# Altium project iiot.PrjPcb
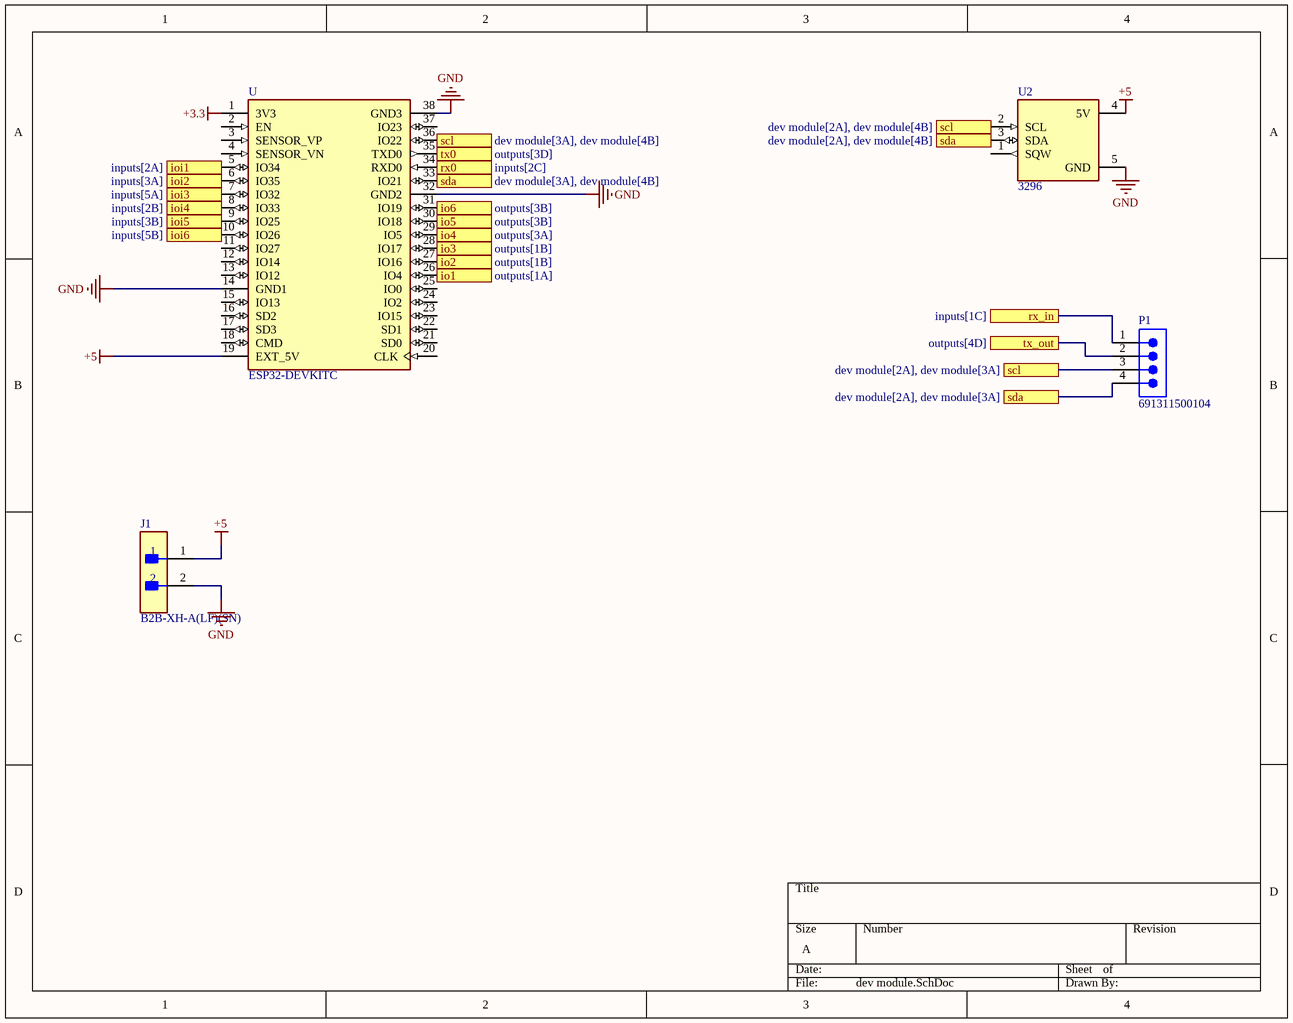
[diagram p0: dev module.SchDoc]
3 sheets, 87 parts. Net scope: flat (ports and power ports of the same name join across sheets).
Board file: with dev module.PcbDoc
Sheets:
  dev module.SchDoc
  outputs.SchDoc
  inputs.SchDoc

## Sheet dev module.SchDoc
size A; SheetNumber: 1; SheetTotal: 3

### Parts
J1  B2B-XH-A(LF)(SN)  [FP-B2B-XH-A_LF_SN-MFG]
P1  691311500104  [691311500104]
U  ESP32-DEVKITC  [MODULE_ESP32-DEVKITC]
U2  3296  [MODULE_3296]

### Ports
io1 (see outputs[1A]), io2 (see outputs[1B]), io3 (see outputs[1B]), io4 (see outputs[3A]), io5 (see outputs[3B]), io6 (see outputs[3B]), ioi1 (see inputs[2A]), ioi2 (see inputs[3A]), ioi3 (see inputs[5A]), ioi4 (see inputs[2B]), ioi5 (see inputs[3B]), ioi6 (see inputs[5B]), rx0 (see inputs[2C]), rx_in (see inputs[1C]), scl (see dev module[2A], dev module[3A]), scl (see dev module[2A], dev module[4B]), scl (see dev module[3A], dev module[4B]), sda (see dev module[2A], dev module[3A]), sda (see dev module[2A], dev module[4B]), sda (see dev module[3A], dev module[4B]), tx0 (see outputs[3D]), tx_out (see outputs[4D])

### Nets
+3.3: U.1(3V3)
+5: J1.1 U.19(EXT_5V) U2.4(5V)
GND: J1.2 U.14(GND1) U.32(GND2) U.38(GND3) U2.5(GND)
NetP1_1: P1.1 ; port rx_in
NetP1_2: P1.2 ; port tx_out
NetP1_3: P1.3 U.36(IO22) U2.2(SCL) ; port scl
NetP1_4: P1.4 U.33(IO21) U2.3(SDA) ; port sda
NetQ14_4: U.5(IO34) ; port ioi1
NetQ15_4: U.6(IO35) ; port ioi2
NetQ16_4: U.7(IO32) ; port ioi3
NetQ17_4: U.8(IO33) ; port ioi4
NetQ18_4: U.9(IO25) ; port ioi5
NetQ19_4: U.10(IO26) ; port ioi6
NetR1_2: U.26(IO4) ; port io1
NetR2_2: U.29(IO5) ; port io4
NetR19_2: U.27(IO16) ; port io2
NetR20_2: U.30(IO18) ; port io5
NetR23_2: U.28(IO17) ; port io3
NetR24_2: U.31(IO19) ; port io6
NetR28_2: U.35(TXD0) ; port tx0
NetU_34: U.34(RXD0) ; port rx0

Not connected (* = marked no-connect by the designer): U 2(EN) 3(SENSOR_VP) 4(SENSOR_VN) 11(IO27) 12(IO14) 13(IO12) 15(IO13) 16(SD2) 17(SD3) 18(CMD) 20(CLK) 21(SD0) 22(SD1) 23(IO15) 24(IO2) 25(IO0) 37(IO23); U2 1(SQW)

### Library data of the parts
J1 = CMP-2000-05888-3: CONN HEADER VERT 2POS 2.5MM; Current Rating: 3A; Voltage Rating: 250V; Number of Contacts: 2; Contact Resistance: 20mR; Wire/Cable Gauge: 22AWG; Insulation Resistance: 1GR; Connector Type: Male Pin; Packaging: Bulk; Contact Material: Brass; Lead Free: Lead Free; Orientation: Straight; Contact Plating: Tin; Max Current Rating: 3A; Termination: Solder; Fastening Type: Detent; Depth: 5.75mm; Housing Material: Polyamide; REACH SVHC: No SVHC; Series: XH; Voltage Rating (AC): 250V; Number of Positions: 2; Color: Natural; Contact Type: Male Pin; Max Voltage Rating (DC): 250V; Pitch: 2.5mm; Lead Pitch: 2.5mm; Mount: Through Hole; Max Operating Temperature: 85°C; Length: 7.4mm; Max Voltage Rating (AC): 250V; Min Operating Temperature: -25°C; Number of Rows: 1; Housing Color: White
P1 = CMP-1502-02148-2: NexarPartId: 8917749; Pitch: 5.08mm; Number of Positions Per Level: 4; Gender: Male; Voltage: 300V; Current: 20A; Number of Levels: 1; Orientation: Vertical; Number of Pins: 4; Mount: Through Hole; Number of Contacts: 4; Length: 8.5mm; Number of Rows: 1; Contact Plating: Tin; Color: Green; Termination: Solder; Contact Material: Brass; REACH SVHC: Unknown; RoHS: Compliant; Lead Pitch: 5.08mm; Width: 22.32mm; Height: 12mm; Packaging: Box
U = ESP32-DEVKITC: - Transceiver; 802.11 b/g/n _Wi-Fi, WiFi, WLAN_, BluetoothÂ® Smart Ready 4.x Dual Mode For Use With ESP-WROOM-32; MP: ESP32-DEVKITC-32D-F; MF: Espressif Systems; Price: None; SnapEDA_Link: https://www.snapeda.com/parts/ESP32-DEVKITC-32D-F/Espressif%20Systems/view-part/4220172/?ref=snap; Availability: Unavailable; Value: *; Package: None
U2 = 3296: DS1307 Real Time Clock (RTC) Timing Evaluation Board; MF: Adafruit; Package: None; Price: None; Check_prices: https://www.snapeda.com/parts/3296/Adafruit+Industries/view-part/?ref=eda; Value: *; SnapEDA_Link: https://www.snapeda.com/parts/3296/Adafruit+Industries/view-part/?ref=snap; MP: 3296; Availability: In Stock; Purchase-URL: https://pricing.snapeda.com/search/part/3296/?ref=eda

## Sheet outputs.SchDoc
size B; SheetNumber: 2; SheetTotal: 3
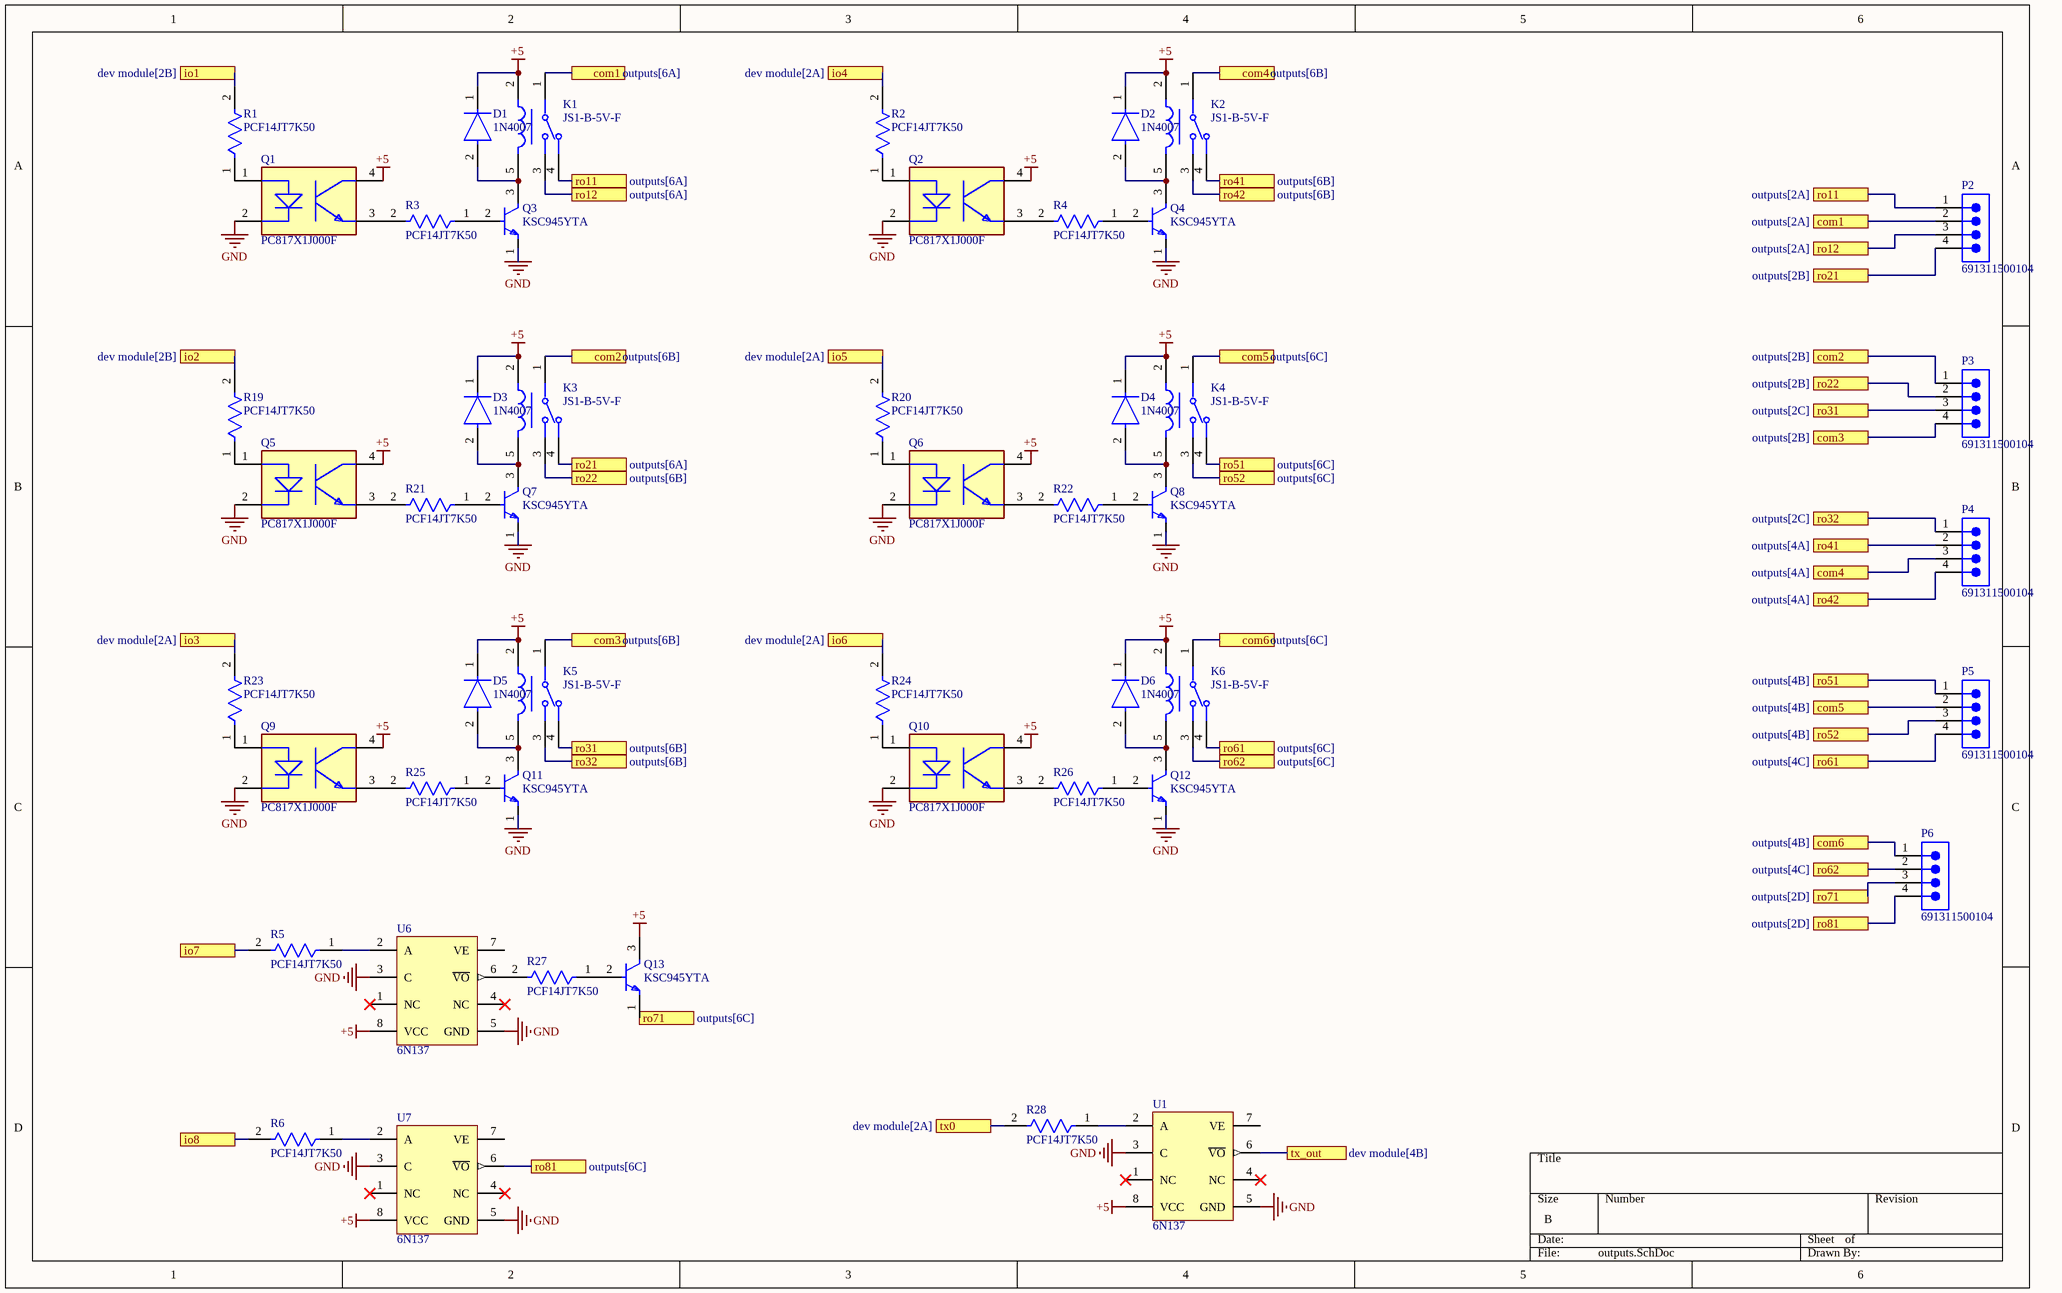
[diagram p1: outputs.SchDoc]

### Parts
D1  1N4007  [FP-1N4007-MFG]
D2  1N4007  [FP-1N4007-MFG]
D3  1N4007  [FP-1N4007-MFG]
D4  1N4007  [FP-1N4007-MFG]
D5  1N4007  [FP-1N4007-MFG]
D6  1N4007  [FP-1N4007-MFG]
K1  JS1-B-5V-F  [FP-JS1-B-5V-F-MFG]
K2  JS1-B-5V-F  [FP-JS1-B-5V-F-MFG]
K3  JS1-B-5V-F  [FP-JS1-B-5V-F-MFG]
K4  JS1-B-5V-F  [FP-JS1-B-5V-F-MFG]
K5  JS1-B-5V-F  [FP-JS1-B-5V-F-MFG]
K6  JS1-B-5V-F  [FP-JS1-B-5V-F-MFG]
P2  691311500104  [691311500104]
P3  691311500104  [691311500104]
P4  691311500104  [691311500104]
P5  691311500104  [691311500104]
P6  691311500104  [691311500104]
Q1  PC817X1J000F  [FP-PC817X1J000F-MFG]
Q2  PC817X1J000F  [FP-PC817X1J000F-MFG]
Q3  KSC945YTA  [FP-135AR-MFG]
Q4  KSC945YTA  [FP-135AR-MFG]
Q5  PC817X1J000F  [FP-PC817X1J000F-MFG]
Q6  PC817X1J000F  [FP-PC817X1J000F-MFG]
Q7  KSC945YTA  [FP-135AR-MFG]
Q8  KSC945YTA  [FP-135AR-MFG]
Q9  PC817X1J000F  [FP-PC817X1J000F-MFG]
Q10  PC817X1J000F  [FP-PC817X1J000F-MFG]
Q11  KSC945YTA  [FP-135AR-MFG]
Q12  KSC945YTA  [FP-135AR-MFG]
Q13  KSC945YTA  [FP-135AR-MFG]
R1  PCF14JT7K50  [FP-CF14-MFG]
R2  PCF14JT7K50  [FP-CF14-MFG]
R3  PCF14JT7K50  [FP-CF14-MFG]
R4  PCF14JT7K50  [FP-CF14-MFG]
R5  PCF14JT7K50  [FP-CF14-MFG]
R6  PCF14JT7K50  [FP-CF14-MFG]
R19  PCF14JT7K50  [FP-CF14-MFG]
R20  PCF14JT7K50  [FP-CF14-MFG]
R21  PCF14JT7K50  [FP-CF14-MFG]
R22  PCF14JT7K50  [FP-CF14-MFG]
R23  PCF14JT7K50  [FP-CF14-MFG]
R24  PCF14JT7K50  [FP-CF14-MFG]
R25  PCF14JT7K50  [FP-CF14-MFG]
R26  PCF14JT7K50  [FP-CF14-MFG]
R27  PCF14JT7K50  [FP-CF14-MFG]
R28  PCF14JT7K50  [FP-CF14-MFG]
U1  6N137  [VISH-DIP-8_A]
U6  6N137  [VISH-DIP-8_A]
U7  6N137  [VISH-DIP-8_A]

### Ports
com1 (see outputs[2A]), com1 (see outputs[6A]), com2 (see outputs[2B]), com2 (see outputs[6B]), com3 (see outputs[2B]), com3 (see outputs[6B]), com4 (see outputs[4A]), com4 (see outputs[6B]), com5 (see outputs[4B]), com5 (see outputs[6C]), com6 (see outputs[4B]), com6 (see outputs[6C]), io1 (see dev module[2B]), io2 (see dev module[2B]), io3 (see dev module[2A]), io4 (see dev module[2A]), io5 (see dev module[2A]), io6 (see dev module[2A]), io7, io8, ro11 (see outputs[2A]), ro11 (see outputs[6A]), ro12 (see outputs[2A]), ro12 (see outputs[6A]), ro21 (see outputs[2B]), ro21 (see outputs[6A]), ro22 (see outputs[2B]), ro22 (see outputs[6B]), ro31 (see outputs[2C]), ro31 (see outputs[6B]), ro32 (see outputs[2C]), ro32 (see outputs[6B]), ro41 (see outputs[4A]), ro41 (see outputs[6B]), ro42 (see outputs[4A]), ro42 (see outputs[6B]), ro51 (see outputs[4B]), ro51 (see outputs[6C]), ro52 (see outputs[4B]), ro52 (see outputs[6C]), ro61 (see outputs[4C]), ro61 (see outputs[6C]), ro62 (see outputs[4C]), ro62 (see outputs[6C]), ro71 (see outputs[2D]), ro71 (see outputs[6C]), ro81 (see outputs[2D]), ro81 (see outputs[6C]), tx0 (see dev module[2A]), tx_out (see dev module[4B])

### Nets
+5: D1.1(C) D2.1(C) D3.1(C) D4.1(C) D5.1(C) D6.1(C) K1.2 K2.2 K3.2 K4.2 K5.2 K6.2 Q1.4(C) Q2.4(C) Q5.4(C) Q6.4(C) Q9.4(C) Q10.4(C) Q13.3(C) U1.8(VCC) U6.8(VCC) U7.8(VCC)
GND: Q1.2(C) Q2.2(C) Q3.1(E) Q4.1(E) Q5.2(C) Q6.2(C) Q7.1(E) Q8.1(E) Q9.2(C) Q10.2(C) Q11.1(E) Q12.1(E) U1.3(C) U1.5(GND) U6.3(C) U6.5(GND) U7.3(C) U7.5(GND)
NetD1_2: D1.2(A) K1.5 Q3.3(C)
NetD2_2: D2.2(A) K2.5 Q4.3(C)
NetD3_2: D3.2(A) K3.5 Q7.3(C)
NetD4_2: D4.2(A) K4.5 Q8.3(C)
NetD5_2: D5.2(A) K5.5 Q11.3(C)
NetD6_2: D6.2(A) K6.5 Q12.3(C)
NetK1_1: K1.1(COM) P2.2 ; port com1
NetK1_3: K1.3(NO) P2.3 ; port ro12
NetK1_4: K1.4(NC) P2.1 ; port ro11
NetK2_1: K2.1(COM) P4.3 ; port com4
NetK2_3: K2.3(NO) P4.4 ; port ro42
NetK2_4: K2.4(NC) P4.2 ; port ro41
NetK3_1: K3.1(COM) P3.1 ; port com2
NetK3_3: K3.3(NO) P3.2 ; port ro22
NetK3_4: K3.4(NC) P2.4 ; port ro21
NetK4_1: K4.1(COM) P5.2 ; port com5
NetK4_3: K4.3(NO) P5.3 ; port ro52
NetK4_4: K4.4(NC) P5.1 ; port ro51
NetK5_1: K5.1(COM) P3.4 ; port com3
NetK5_3: K5.3(NO) P4.1 ; port ro32
NetK5_4: K5.4(NC) P3.3 ; port ro31
NetK6_1: K6.1(COM) P6.1 ; port com6
NetK6_3: K6.3(NO) P6.2 ; port ro62
NetK6_4: K6.4(NC) P5.4 ; port ro61
NetP1_2: U1.6(~{VO}) ; port tx_out
NetP6_3: P6.3 Q13.1(E) ; port ro71
NetP6_4: P6.4 U7.6(~{VO}) ; port ro81
NetQ1_1: Q1.1(A) R1.1
NetQ1_3: Q1.3(E) R3.2
NetQ2_1: Q2.1(A) R2.1
NetQ2_3: Q2.3(E) R4.2
NetQ3_2: Q3.2(B) R3.1
NetQ4_2: Q4.2(B) R4.1
NetQ5_1: Q5.1(A) R19.1
NetQ5_3: Q5.3(E) R21.2
NetQ6_1: Q6.1(A) R20.1
NetQ6_3: Q6.3(E) R22.2
NetQ7_2: Q7.2(B) R21.1
NetQ8_2: Q8.2(B) R22.1
NetQ9_1: Q9.1(A) R23.1
NetQ9_3: Q9.3(E) R25.2
NetQ10_1: Q10.1(A) R24.1
NetQ10_3: Q10.3(E) R26.2
NetQ11_2: Q11.2(B) R25.1
NetQ12_2: Q12.2(B) R26.1
NetQ13_2: Q13.2(B) R27.1
NetR1_2: R1.2 ; port io1
NetR2_2: R2.2 ; port io4
NetR5_1: R5.1 U6.2(A)
NetR5_2: R5.2 ; port io7
NetR6_1: R6.1 U7.2(A)
NetR6_2: R6.2 ; port io8
NetR19_2: R19.2 ; port io2
NetR20_2: R20.2 ; port io5
NetR23_2: R23.2 ; port io3
NetR24_2: R24.2 ; port io6
NetR27_2: R27.2 U6.6(~{VO})
NetR28_1: R28.1 U1.2(A)
NetR28_2: R28.2 ; port tx0

Not connected (* = marked no-connect by the designer): U1 1(NC)* 4(NC)* 7(VE); U6 1(NC)* 4(NC)* 7(VE); U7 1(NC)* 4(NC)* 7(VE)

### Library data of the parts
D1-D6 = CMP-123542-000001-1: Rectifier diode 1000 V 1 A DO-41, ,; Manufacturer: Diotec; Max Surge Forward Current: 27A; Forward Current: 1A; Max Junction Temp: +175°C; Reverse Voltage: 1000V; Value: 15pF; Peak Reverse Current: 5uA; Category: Diode; Temperature Range Low: -50°C; Automotive: No; Temperature: -50°C to +175°C; Lead Free: Yes; ComponentLink2Description: Datasheet; Max Repetitive Reverse Voltage: 1000V; ComponentLink2URL: https://datasheet.octopart.com/1N4007-Diotec-datasheet-62346875.pdf; Manufacturer Part Number: 1N4007; Device Class L3: Rectifier Diodes; Height: 2.8mm; Octopart: https://octopart.com/1n4007-diotec-4040411; Package: 1N4007; Temperature Range High: +175°C; Device Class L1: Discrete Semiconductors; Device Class L2: Diodes; RoHS: TRUE; Capacitance: 15pF; Ipc Land Pattern Name: DIOAD888W100L520D280
K1-K6 = CMP-00287-00689748-1: JS1-B-5V-F Electromechanical Relay 5VDC 69.4Ohm 5ADC/10AAC SPDT (22x16x16.4)mm THT Power Relay; NexarPartId: 689748; Coil Voltage (DC): 5V; Coil Resistance: 69.4Ω; Coil Power: 360mW; Voltage Rating (AC): 250V; Number of Contacts: 1; Coil Type: Non-Latching; Current Rating: 10A; Coil Current: 72mA; Operate Time: 10ms; Max Voltage Rating (DC): 100V; Relay Type: General Purpose; Throw Configuration: SPDT; Depth: 16mm; Lead Free: Lead Free; Contact Material: Silver, Tin; Max Operating Temperature: 85°C; Number of Pins: 5; Mount: Through Hole; Ambient Temperature Range High: 85°C; Height: 16mm; Weight: 12g; Power Consumption: 360mW; REACH SVHC: No SVHC; Min Operating Temperature: -40°C; Termination: PC Pin; Width: 22mm; Max Current Rating: 10A; Packaging: Bulk; Length: 22mm; Switching Current: 10A; Power Rating: 360mW; RoHS: Compliant; Max Voltage Rating (AC): 250V; Release Time: 10ms; Contact Current Rating: 10A
P2-P6 = CMP-1502-02148-2: as P1 on sheet dev module; Orientation: Vertical; Number of Pins: 4; Mount: Through Hole; Number of Contacts: 4; Length: 8.5mm; Number of Rows: 1; Contact Plating: Tin; Color: Green; Termination: Solder; Contact Material: Brass; REACH SVHC: Unknown; RoHS: Compliant; Lead Pitch: 5.08mm; Width: 22.32mm; Height: 12mm; Packaging: Box
Q1 Q2 Q5 Q6 Q9 Q10 = CMP-65434-000003-1: OPTOISOLATOR 5KV TRANS 4DIP; Collector Emitter Saturation Voltage: 200mV; Forward Voltage: 1.4V; Power Dissipation: 200mW; Input Current: 20mA; Max Collector Current: 50mA; Collector Emitter Breakdown Voltage: 80V; Rise Time: 18000ns; Number of Elements: 1; Reverse Breakdown Voltage: 6V; Current Transfer Ratio: 600%; Min Operating Temperature: -30°C; Number of Pins: 4; Radiation Hardening: No; Output Current per Channel: 50mA; Case/Package: DIP; Fall Time: 18000ns; Forward Current: 50mA; Isolation Voltage: 5kV; Package Quantity: 2000; Max Operating Temperature: 100°C; Packaging: Sleeve; Max Input Current: 50mA; Output Voltage: 80V; Max Power Dissipation: 200mW; Mount: Through Hole; Number of Channels: 1; Collector Emitter Voltage (VCEO): 80V
Q3 Q4 Q7 Q8 Q11-Q13 = CMP-00278-84329536-1: KSC945YTA Bipolar (BJT) Single Transistor, NPN, 50 V, 300 MHz, 250 mW, 150 mA, 120; Manufacturer Lifecycle Status: ACTIVE; Collector Base Voltage (VCBO): 60V; Frequency: 300MHz; Max Frequency: 1MHz; Max Junction Temperature (Tj): 150°C; Max Power Dissipation: 250mW; Max Collector Current: 150mA; Collector Emitter Breakdown Voltage: 50V; Emitter Base Voltage (VEBO): 5V; hFE Min: 40; Collector Emitter Saturation Voltage: 150mV; Number of Elements: 1; Schedule B: 8541210080, 8541210080; Max Operating Temperature: 150°C; RoHS: Compliant; Gain Bandwidth Product: 300MHz; Width: 3.86mm; REACH SVHC: No SVHC; Height: 4.58mm; Number of Pins: 3; Radiation Hardening: No; Weight: 240mg; Element Configuration: Single; Transition Frequency: 300MHz; NexarPartId: 84329536; Voltage Rating (DC): 50V; Power Dissipation: 250mW; Min Operating Temperature: -55°C; Max Breakdown Voltage: 50V; Lifecycle Status: Production; Collector Emitter Voltage (VCEO): 50V; Mount: Through Hole; Length: 4.58mm; Polarity: NPN; Lead Free: Lead Free; Current Rating: 150mA; Case/Package: TO-92-3
R1-R6 R19-R28 = CMP-26528-000003-1: RES 7.5K OHM 1/4W 5% AXIAL; Max Power Dissipation: 250mW; Temperature Coefficient: -400ppm/°C; Resistance: 7.5kR; RoHS Compliant: Yes; Lead Free: Lead Free; Max Operating Temperature: 155°C; Case/Package: Axial; Tolerance: 5%; Power Rating: 250mW; Diameter: 2.3mm; Features: Flame Retardant Coating; Series: CF; Resistor Type: Carbon Film; Number of Terminations: 2; Length: 0.256inch; Min Operating Temperature: -55°C; Contact Plating: Tin; Packaging: Tape and Reel; Mount: Through Hole; Radiation Hardening: No
U1 U6 U7 = CMP-2000-05669-1: High Speed Optocoupler, Single and Dual, 10 MBd, 5 V, -40 to 100 degC, 8-Pin DIP, RoHS, Tube; Manufacturer: Vishay; No. of Channels: 1Channel; Isolation Voltage: 5.3kV; Data Rate: 10Mbaud; SVHC: ToBeAdvised; No. of Pins: 8Pins; Package Description: 8-Pin Double In-line Package, Body 10.16 x 6.7 mm, Pitch 2.54 mm; Manufacturer URL: http://www.vishay.com/; Product Range: -; Optocoupler Case Style: DIP; Mounting Technology: ThroughHole; Packaging: Each; Package Reference: DIP-8; Datasheet Version: Rev. 1.9, 03/2015; Datasheet URL: http://www.vishay.com/docs/84732/6n137.pdf

## Sheet inputs.SchDoc
size B; SheetNumber: 3; SheetTotal: 3
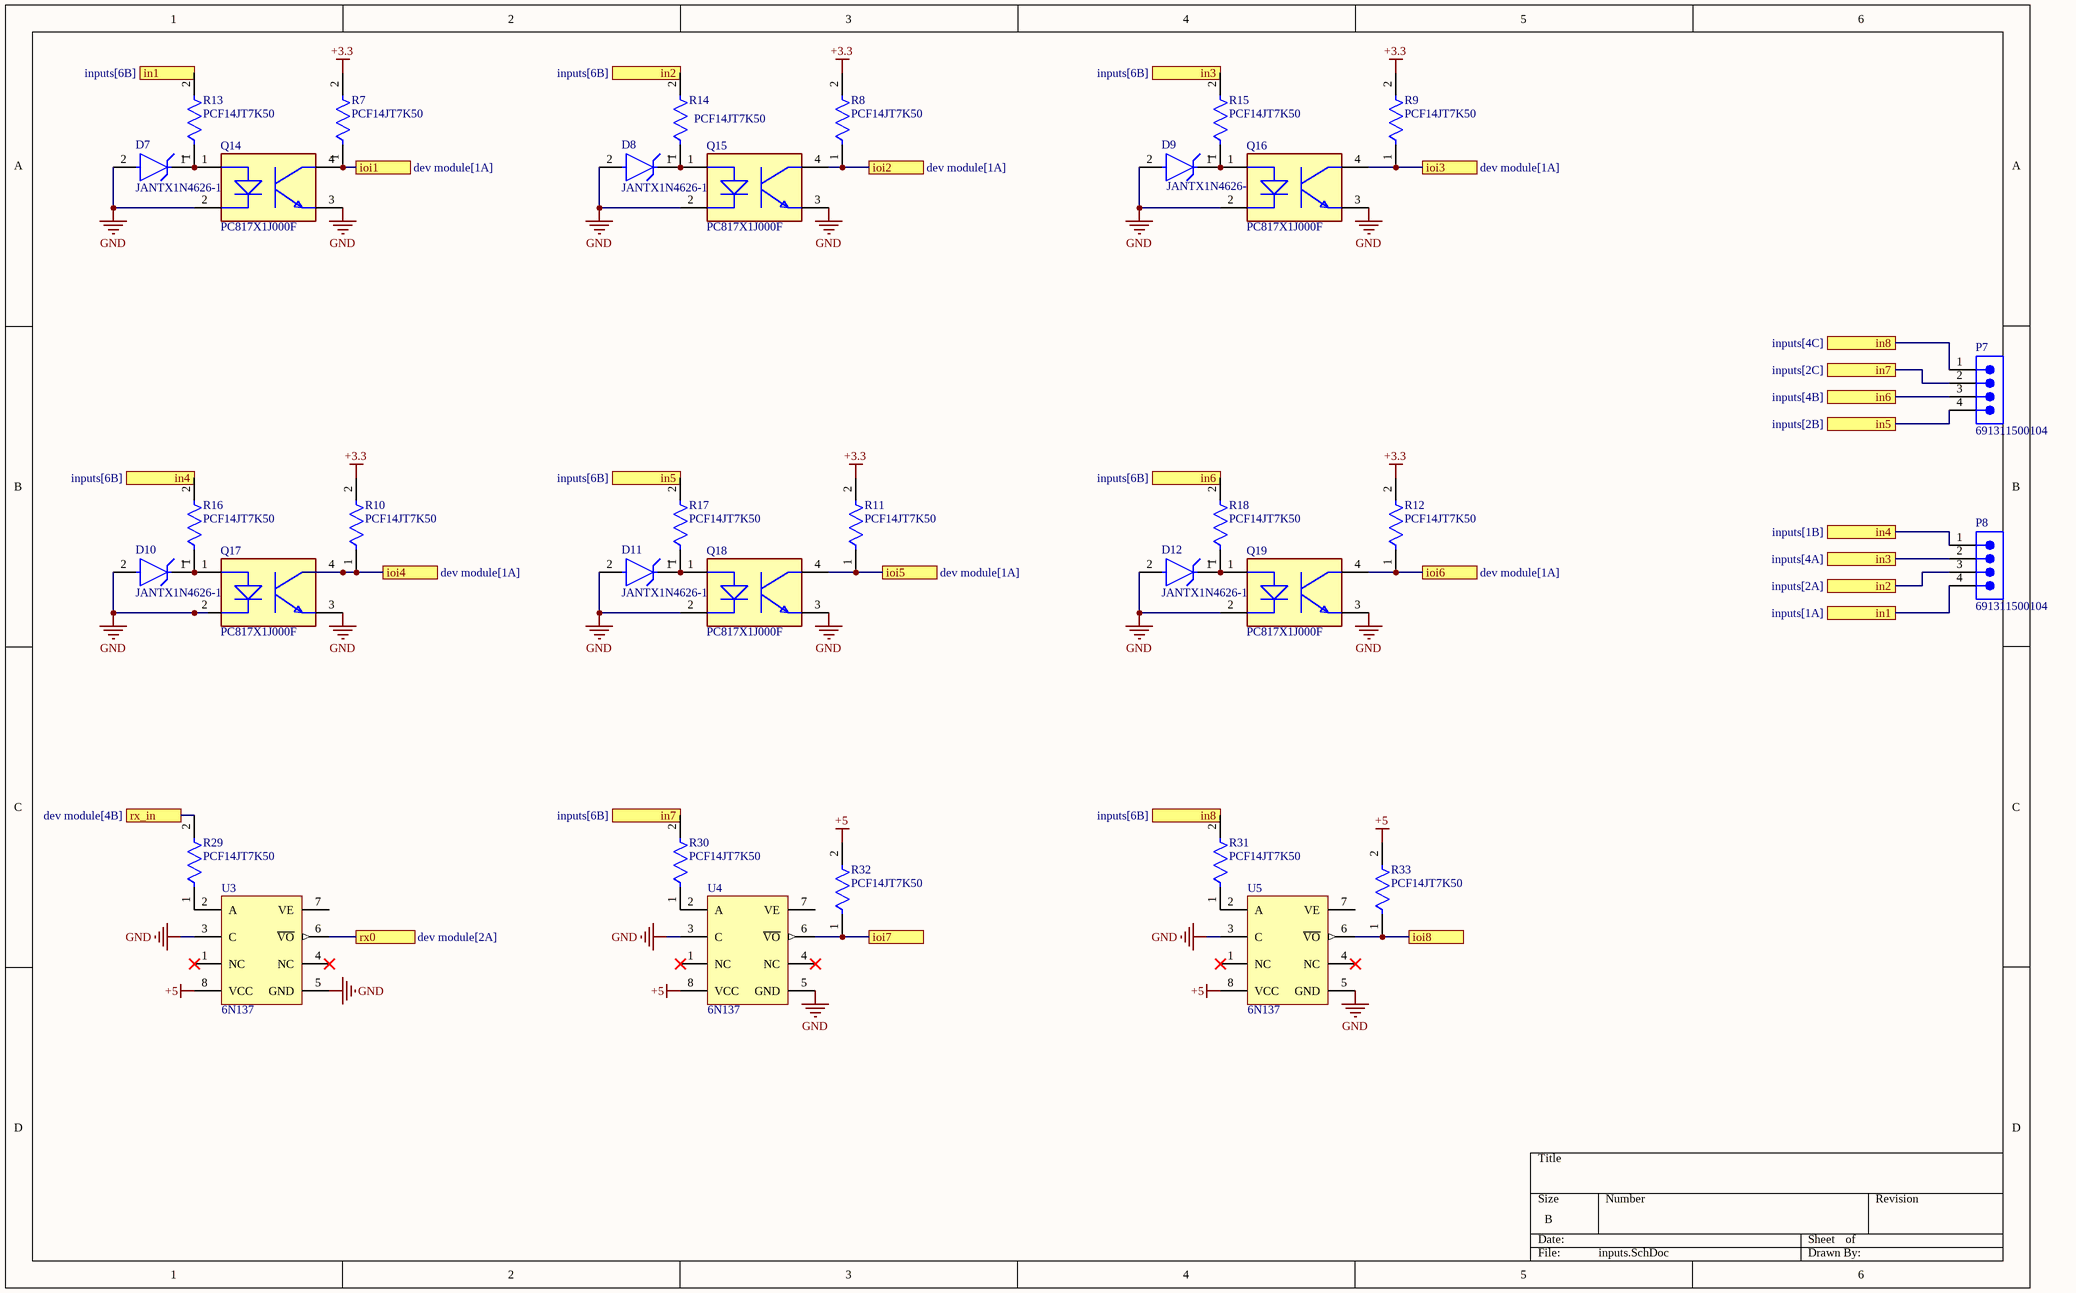
[diagram p2: inputs.SchDoc]

### Parts
D7  JANTX1N4626-1  [FP-DO-35-MFG]
D8  JANTX1N4626-1  [FP-DO-35-MFG]
D9  JANTX1N4626-1  [FP-DO-35-MFG]
D10  JANTX1N4626-1  [FP-DO-35-MFG]
D11  JANTX1N4626-1  [FP-DO-35-MFG]
D12  JANTX1N4626-1  [FP-DO-35-MFG]
P7  691311500104  [691311500104]
P8  691311500104  [691311500104]
Q14  PC817X1J000F  [FP-PC817X1J000F-MFG]
Q15  PC817X1J000F  [FP-PC817X1J000F-MFG]
Q16  PC817X1J000F  [FP-PC817X1J000F-MFG]
Q17  PC817X1J000F  [FP-PC817X1J000F-MFG]
Q18  PC817X1J000F  [FP-PC817X1J000F-MFG]
Q19  PC817X1J000F  [FP-PC817X1J000F-MFG]
R7  PCF14JT7K50  [FP-CF14-MFG]
R8  PCF14JT7K50  [FP-CF14-MFG]
R9  PCF14JT7K50  [FP-CF14-MFG]
R10  PCF14JT7K50  [FP-CF14-MFG]
R11  PCF14JT7K50  [FP-CF14-MFG]
R12  PCF14JT7K50  [FP-CF14-MFG]
R13  PCF14JT7K50  [FP-CF14-MFG]
R14  PCF14JT7K50  [FP-CF14-MFG]
R15  PCF14JT7K50  [FP-CF14-MFG]
R16  PCF14JT7K50  [FP-CF14-MFG]
R17  PCF14JT7K50  [FP-CF14-MFG]
R18  PCF14JT7K50  [FP-CF14-MFG]
R29  PCF14JT7K50  [FP-CF14-MFG]
R30  PCF14JT7K50  [FP-CF14-MFG]
R31  PCF14JT7K50  [FP-CF14-MFG]
R32  PCF14JT7K50  [FP-CF14-MFG]
R33  PCF14JT7K50  [FP-CF14-MFG]
U3  6N137  [VISH-DIP-8_A]
U4  6N137  [VISH-DIP-8_A]
U5  6N137  [VISH-DIP-8_A]

### Ports
in1 (see inputs[1A]), in1 (see inputs[6B]), in2 (see inputs[2A]), in2 (see inputs[6B]), in3 (see inputs[4A]), in3 (see inputs[6B]), in4 (see inputs[1B]), in4 (see inputs[6B]), in5 (see inputs[2B]), in5 (see inputs[6B]), in6 (see inputs[4B]), in6 (see inputs[6B]), in7 (see inputs[2C]), in7 (see inputs[6B]), in8 (see inputs[4C]), in8 (see inputs[6B]), ioi1 (see dev module[1A]), ioi2 (see dev module[1A]), ioi3 (see dev module[1A]), ioi4 (see dev module[1A]), ioi5 (see dev module[1A]), ioi6 (see dev module[1A]), ioi7, ioi8, rx0 (see dev module[2A]), rx_in (see dev module[4B])

### Nets
+3.3: R7.2 R8.2 R9.2 R10.2 R11.2 R12.2
+5: R32.2 R33.2 U3.8(VCC) U4.8(VCC) U5.8(VCC)
GND: D7.2(A) D8.2(A) D9.2(A) D10.2(A) D11.2(A) D12.2(A) Q14.2(C) Q14.3(E) Q15.2(C) Q15.3(E) Q16.2(C) Q16.3(E) Q17.2(C) Q17.3(E) Q18.2(C) Q18.3(E) Q19.2(C) Q19.3(E) U3.3(C) U3.5(GND) U4.3(C) U4.5(GND) U5.3(C) U5.5(GND)
NetD7_1: D7.1(C) Q14.1(A) R13.1
NetD8_1: D8.1(C) Q15.1(A) R14.1
NetD9_1: D9.1(C) Q16.1(A) R15.1
NetD10_1: D10.1(C) Q17.1(A) R16.1
NetD11_1: D11.1(C) Q18.1(A) R17.1
NetD12_1: D12.1(C) Q19.1(A) R18.1
NetP1_1: R29.2 ; port rx_in
NetP7_1: P7.1 R31.2 ; port in8
NetP7_2: P7.2 R30.2 ; port in7
NetP7_3: P7.3 R18.2 ; port in6
NetP7_4: P7.4 R17.2 ; port in5
NetP8_1: P8.1 R16.2 ; port in4
NetP8_2: P8.2 R15.2 ; port in3
NetP8_3: P8.3 R14.2 ; port in2
NetP8_4: P8.4 R13.2 ; port in1
NetQ14_4: Q14.4(C) R7.1 ; port ioi1
NetQ15_4: Q15.4(C) R8.1 ; port ioi2
NetQ16_4: Q16.4(C) R9.1 ; port ioi3
NetQ17_4: Q17.4(C) R10.1 ; port ioi4
NetQ18_4: Q18.4(C) R11.1 ; port ioi5
NetQ19_4: Q19.4(C) R12.1 ; port ioi6
NetR29_1: R29.1 U3.2(A)
NetR30_1: R30.1 U4.2(A)
NetR31_1: R31.1 U5.2(A)
NetR32_1: R32.1 U4.6(~{VO}) ; port ioi7
NetR33_1: R33.1 U5.6(~{VO}) ; port ioi8
NetU_34: U3.6(~{VO}) ; port rx0

Not connected (* = marked no-connect by the designer): U3 1(NC)* 4(NC)* 7(VE); U4 1(NC)* 4(NC)* 7(VE); U5 1(NC)* 4(NC)* 7(VE)

### Library data of the parts
D7-D12 = CMP-00252-10349970-1: JANTX1N4626-1 Metallurgically Bonded Glass Zener Diode 5.6V 500mW 5% 2-Pin DO-204AH; Impedance: 1.4kΩ; Element Configuration: Single; Max Reverse Leakage Current: 10µA; Test Current: 250µA; Power Dissipation: 480mW; Mount: Through Hole; Max Operating Temperature: 175°C; Min Operating Temperature: -65°C; Max Power Dissipation: 500mW; Tolerance: 5%; Voltage Tolerance: 5%; Lifecycle Status: Production; Number of Pins: 2; RoHS: Compliant; Schedule B: 8541100050, 8541100050; Lead Free: Contains Lead; Zener Voltage: 5.6V; NexarPartId: 10349970; Radiation Hardening: No
P7 P8 = CMP-1502-02148-2: as P1 on sheet dev module; Orientation: Vertical; Number of Pins: 4; Mount: Through Hole; Number of Contacts: 4; Length: 8.5mm; Number of Rows: 1; Contact Plating: Tin; Color: Green; Termination: Solder; Contact Material: Brass; REACH SVHC: Unknown; RoHS: Compliant; Lead Pitch: 5.08mm; Width: 22.32mm; Height: 12mm; Packaging: Box
Q14-Q19 = CMP-65434-000003-1: as Q1 on sheet outputs; Min Operating Temperature: -30°C; Number of Pins: 4; Radiation Hardening: No; Output Current per Channel: 50mA; Case/Package: DIP; Fall Time: 18000ns; Forward Current: 50mA; Isolation Voltage: 5kV; Package Quantity: 2000; Max Operating Temperature: 100°C; Packaging: Sleeve; Max Input Current: 50mA; Output Voltage: 80V; Max Power Dissipation: 200mW; Mount: Through Hole; Number of Channels: 1; Collector Emitter Voltage (VCEO): 80V
R7-R18 R29-R33 = CMP-26528-000003-1: as R1 on sheet outputs; RoHS Compliant: Yes; Lead Free: Lead Free; Max Operating Temperature: 155°C; Case/Package: Axial; Tolerance: 5%; Power Rating: 250mW; Diameter: 2.3mm; Features: Flame Retardant Coating; Series: CF; Resistor Type: Carbon Film; Number of Terminations: 2; Length: 0.256inch; Min Operating Temperature: -55°C; Contact Plating: Tin; Packaging: Tape and Reel; Mount: Through Hole; Radiation Hardening: No
U3-U5 = CMP-2000-05669-1: as U1 on sheet outputs; Package Description: 8-Pin Double In-line Package, Body 10.16 x 6.7 mm, Pitch 2.54 mm; Manufacturer URL: http://www.vishay.com/; Product Range: -; Optocoupler Case Style: DIP; Mounting Technology: ThroughHole; Packaging: Each; Package Reference: DIP-8; Datasheet Version: Rev. 1.9, 03/2015; Datasheet URL: http://www.vishay.com/docs/84732/6n137.pdf

## Nets that join several sheets
+3.3: dev module (U.1), inputs (6 pins)
+5: dev module (J1.1 U.19 U2.4), outputs (22 pins), inputs (5 pins)
GND: dev module (5 pins), outputs (18 pins), inputs (24 pins)
NetP1_1: dev module (P1.1), inputs (R29.2)
NetP1_2: dev module (P1.2), outputs (U1.6)
NetQ14_4: dev module (U.5), inputs (Q14.4 R7.1)
NetQ15_4: dev module (U.6), inputs (Q15.4 R8.1)
NetQ16_4: dev module (U.7), inputs (Q16.4 R9.1)
NetQ17_4: dev module (U.8), inputs (Q17.4 R10.1)
NetQ18_4: dev module (U.9), inputs (Q18.4 R11.1)
NetQ19_4: dev module (U.10), inputs (Q19.4 R12.1)
NetR1_2: dev module (U.26), outputs (R1.2)
NetR2_2: dev module (U.29), outputs (R2.2)
NetR19_2: dev module (U.27), outputs (R19.2)
NetR20_2: dev module (U.30), outputs (R20.2)
NetR23_2: dev module (U.28), outputs (R23.2)
NetR24_2: dev module (U.31), outputs (R24.2)
NetR28_2: dev module (U.35), outputs (R28.2)
NetU_34: dev module (U.34), inputs (U3.6)